# EasyEDA Pro project ProPrj_PCB_2025-05-19.epro, board 连接杆0.2
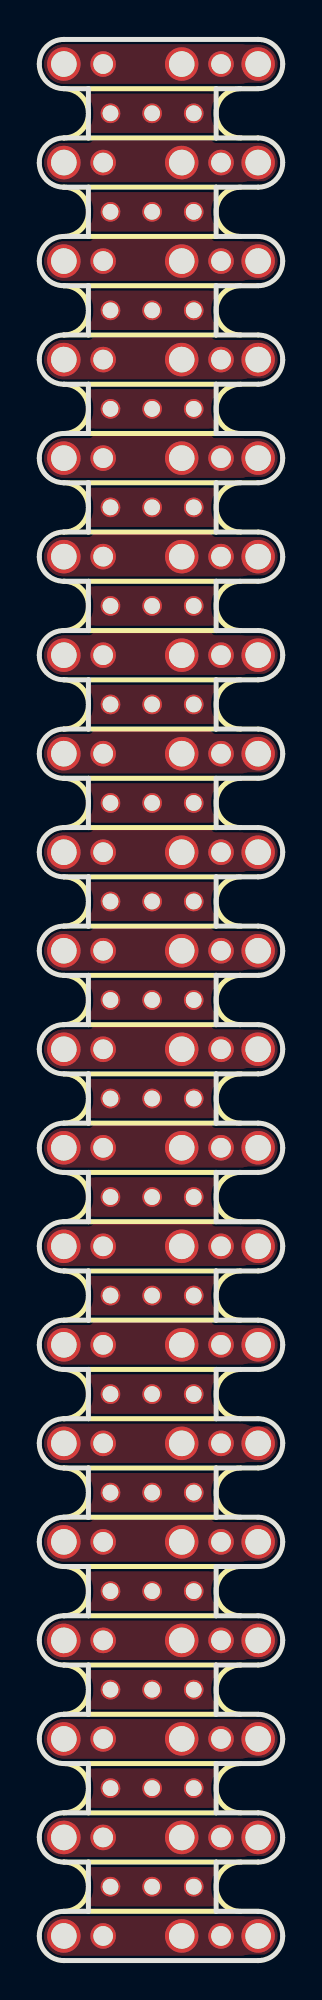
[diagram p6: board, top side]
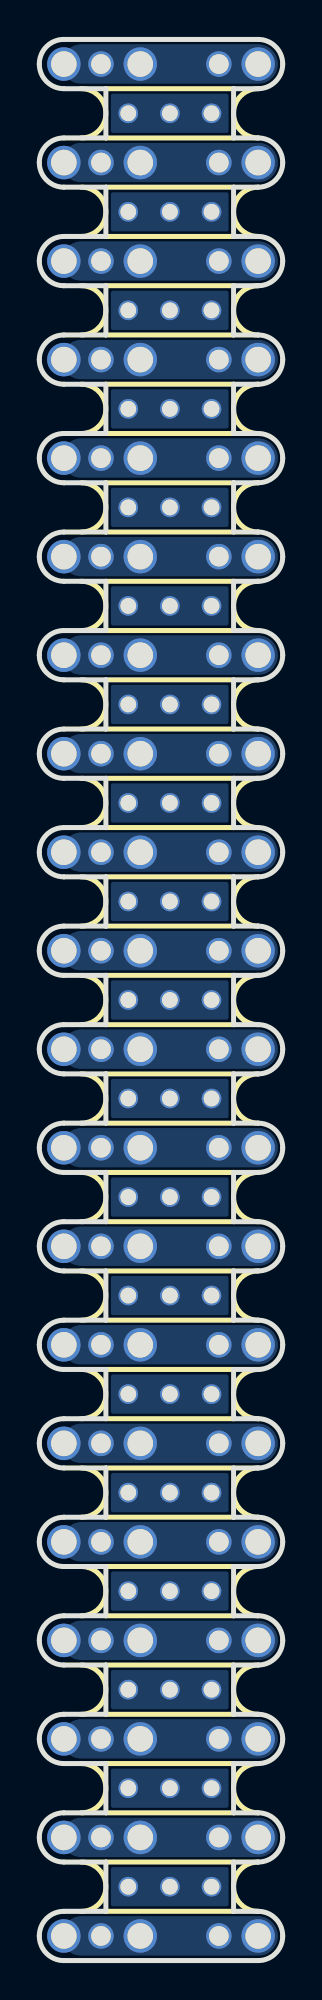
[diagram p7: board, bottom side, seen from below]

Outline 12.39 x 97.5 mm; copper layers: Top Layer, Bottom Layer. Coordinates in mm from the lower left corner of the outline.
Outline path: 0,96.25 arc(0.37,97.13) 1.25,97.5 11.14,97.5 arc(12.02,97.13) 12.39,96.25 arc(12.02,95.37) 11.14,95 9,95 9,92.5 11.14,92.5 arc(12.02,92.13) 12.39,91.25 arc(12.02,90.37) 11.14,90 9,90 9,87.5 11.14,87.5 arc(12.02,87.13) 12.39,86.25 arc(12.02,85.37) 11.14,85 9,85 9,82.5 11.14,82.5 arc(12.02,82.13) 12.39,81.25 arc(12.02,80.37) 11.14,80 9,80 9,77.5 11.14,77.5 arc(12.02,77.13) 12.39,76.25 arc(12.02,75.37) 11.14,75 9,75 9,72.5 11.14,72.5 arc(12.02,72.13) 12.39,71.25 arc(12.02,70.37) 11.14,70 9,70 9,67.5 11.14,67.5 arc(12.02,67.13) 12.39,66.25 arc(12.02,65.37) 11.14,65 9,65 9,62.5 11.14,62.5 arc(12.02,62.13) 12.39,61.25 arc(12.02,60.37) 11.14,60 9,60 9,57.5 11.14,57.5 arc(12.02,57.13) 12.39,56.25 arc(12.02,55.37) 11.14,55 9,55 9,52.5 11.14,52.5 arc(12.02,52.13) 12.39,51.25 arc(12.02,50.37) 11.14,50 9,50 9,47.5 11.14,47.5 arc(12.02,47.13) 12.39,46.25 arc(12.02,45.37) 11.14,45 9,45 9,42.5 11.14,42.5 arc(12.02,42.13) 12.39,41.25 arc(12.02,40.37) 11.14,40 9,40 9,37.5 11.14,37.5 arc(12.02,37.13) 12.39,36.25 arc(12.02,35.37) 11.14,35 9,35 9,32.5 11.14,32.5 arc(12.02,32.13) 12.39,31.25 arc(12.02,30.37) 11.14,30 9,30 9,27.5 11.14,27.5 arc(12.02,27.13) 12.39,26.25 arc(12.02,25.37) 11.14,25 9,25 9,22.5 11.14,22.5 arc(12.02,22.13) 12.39,21.25 arc(12.02,20.37) 11.14,20 9,20 9,17.5 11.14,17.5 arc(12.02,17.13) 12.39,16.25 arc(12.02,15.37) 11.14,15 9,15 9,12.5 11.14,12.5 arc(12.02,12.13) 12.39,11.25 arc(12.02,10.37) 11.14,10 9,10 9,7.5 11.14,7.5 arc(12.02,7.13) 12.39,6.25 arc(12.02,5.37) 11.14,5 9,5 9,2.5 11.14,2.5 arc(12.02,2.13) 12.39,1.25 arc(12.02,0.37) 11.14,0 1.25,0 arc(0.37,0.37) 0,1.25 arc(0.37,2.13) 1.25,2.5 2.5,2.5 2.5,5 1.25,5 arc(0.37,5.37) 0,6.25 arc(0.37,7.13) 1.25,7.5 2.5,7.5 2.5,10 1.25,10 arc(0.37,10.37) 0,11.25 arc(0.37,12.13) 1.25,12.5 2.5,12.5 2.5,15 1.25,15 arc(0.37,15.37) 0,16.25 arc(0.37,17.13) 1.25,17.5 2.5,17.5 2.5,20 1.25,20 arc(0.37,20.37) 0,21.25 arc(0.37,22.13) 1.25,22.5 2.5,22.5 2.5,25 1.25,25 arc(0.37,25.37) 0,26.25 arc(0.37,27.13) 1.25,27.5 2.5,27.5 2.5,30 1.25,30 arc(0.37,30.37) 0,31.25 arc(0.37,32.13) 1.25,32.5 2.5,32.5 2.5,35 1.25,35 arc(0.37,35.37) 0,36.25 arc(0.37,37.13) 1.25,37.5 2.5,37.5 2.5,40 1.25,40 arc(0.37,40.37) 0,41.25 arc(0.37,42.13) 1.25,42.5 2.5,42.5 2.5,45 1.25,45 arc(0.37,45.37) 0,46.25 arc(0.37,47.13) 1.25,47.5 2.5,47.5 2.5,50 1.25,50 arc(0.37,50.37) 0,51.25 arc(0.37,52.13) 1.25,52.5 2.5,52.5 2.5,55 1.25,55 arc(0.37,55.37) 0,56.25 arc(0.37,57.13) 1.25,57.5 2.5,57.5 2.5,60 1.25,60 arc(0.37,60.37) 0,61.25 arc(0.37,62.13) 1.25,62.5 2.5,62.5 2.5,65 1.25,65 arc(0.37,65.37) 0,66.25 arc(0.37,67.13) 1.25,67.5 2.5,67.5 2.5,70 1.25,70 arc(0.37,70.37) 0,71.25 arc(0.37,72.13) 1.25,72.5 2.5,72.5 2.5,75 1.25,75 arc(0.37,75.37) 0,76.25 arc(0.37,77.13) 1.25,77.5 2.5,77.5 2.5,80 1.25,80 arc(0.37,80.37) 0,81.25 arc(0.37,82.13) 1.25,82.5 2.5,82.5 2.5,85 1.25,85 arc(0.37,85.37) 0,86.25 arc(0.37,87.13) 1.25,87.5 2.5,87.5 2.5,90 1.25,90 arc(0.37,90.37) 0,91.25 arc(0.37,92.13) 1.25,92.5 2.5,92.5 2.5,95 1.25,95 arc(0.37,95.37) 0,96.25
Stack: Top Layer 0.035mm / Dielectric1 1.51mm FR4 er 4.5 / Bottom Layer 0.035mm

## Design rules (mm)
template: 自定义配置
spacing copperThickness1oz (default): track to track 0.102, other pairs 0.152 to 0.3
spacing copperThickness2oz: track to track 0.203, other pairs 0.152 to 0.3
track width copperThickness1oz (default): min 0.127, default 0.254, max 2.54
track width copperThickness2oz: min 0.203, default 0.254, max 2.54
differential pair differentialPair (default): width min 0.127, default 0.254, max 2.54; gap min 0.152, default 0.152
via viaSize (default): diameter min 0.5, default 0.61, max 10; hole min 0.3, default 0.305, max 6.3

## Placement (name value [footprint] x y rotation side)
NOREF  -  [Pad_e662]  3.62 73.75 180 top
NOREF#2  -  [Pad_e17]  3.25 1.25 180 top
NOREF#3  -  [Pad_e696]  7.86 13.75 0 top
NOREF#4  -  [Pad_e474]  3.25 81.25 180 top
NOREF#5  -  [Pad_e423]  7.25 66.25 180 top
NOREF#6  -  [Pad_e473]  1.25 81.25 180 top
NOREF#7  -  [Pad_e185]  7.25 36.25 180 top
NOREF#8  -  [Pad_e663]  7.86 68.75 0 top
NOREF#9  -  [Pad_e675]  7.86 48.75 0 top
NOREF#10  -  [Pad_e665]  3.62 68.75 180 top
NOREF#11  -  [Pad_e685]  5.74 33.75 180 top
NOREF#12  -  [Pad_e524]  1.25 96.25 180 top
NOREF#13  -  [Pad_e693]  7.86 18.75 0 top
NOREF#14  -  [Pad_e699]  7.86 8.75 0 top
NOREF#15  -  [Pad_e373]  9.25 51.25 180 top
NOREF#16  -  [Pad_e460]  11.14 76.25 180 top
NOREF#17  -  [Pad_e151]  7.25 26.25 180 top
NOREF#18  -  [Pad_e94]  7.25 16.25 180 top
NOREF#19  -  [Pad_e421]  1.25 66.25 180 top
NOREF#20  -  [Pad_e406]  7.25 61.25 180 top
NOREF#21  -  [Pad_e658]  5.74 78.75 180 top
NOREF#22  -  [Pad_e678]  7.86 43.75 0 top
NOREF#23  -  [Pad_e70]  7.25 6.25 180 top
NOREF#24  -  [Pad_e692]  3.62 23.75 180 top
NOREF#25  -  [Pad_e438]  1.25 71.25 180 top
NOREF#26  -  [Pad_e96]  11.14 16.25 180 top
NOREF#27  -  [Pad_e654]  7.86 83.75 0 top
NOREF#28  -  [Pad_e667]  5.74 63.75 180 top
NOREF#29  -  [Pad_e92]  1.25 16.25 180 top
NOREF#30  -  [Pad_e79]  1.25 11.25 180 top
NOREF#31  -  [Pad_e649]  5.74 93.75 180 top
NOREF#32  -  [Pad_e106]  3.25 21.25 180 top
NOREF#33  -  [Pad_e666]  7.86 63.75 0 top
NOREF#34  -  [Pad_e494]  11.14 86.25 180 top
NOREF#35  -  [Pad_e187]  11.14 36.25 180 top
NOREF#36  -  [Pad_e694]  5.74 18.75 180 top
NOREF#37  -  [Pad_e95]  9.25 16.25 180 top
NOREF#38  -  [Pad_e701]  3.62 8.75 180 top
NOREF#39  -  [Pad_e390]  9.25 56.25 180 top
NOREF#40  -  [Pad_e656]  3.62 83.75 180 top
NOREF#41  -  [Pad_e650]  7.86 93.75 0 top
NOREF#42  -  [Pad_e68]  1.25 6.25 180 top
NOREF#43  -  [Pad_e108]  9.25 21.25 180 top
NOREF#44  -  [Pad_e407]  9.25 61.25 180 top
NOREF#45  -  [Pad_e425]  11.14 66.25 180 top
NOREF#46  -  [Pad_e660]  7.86 73.75 0 top
NOREF#47  -  [Pad_e152]  9.25 26.25 180 top
NOREF#48  -  [Pad_e526]  7.25 96.25 180 top
NOREF#49  -  [Pad_e150]  3.25 26.25 180 top
NOREF#50  -  [Pad_e186]  9.25 36.25 180 top
NOREF#51  -  [Pad_e507]  1.25 91.25 180 top
NOREF#52  -  [Pad_e109]  11.14 21.25 180 top
NOREF#53  -  [Pad_e458]  7.25 76.25 180 top
NOREF#54  -  [Pad_e107]  7.25 21.25 180 top
NOREF#55  -  [Pad_e527]  9.25 96.25 180 top
NOREF#56  -  [Pad_e169]  9.25 31.25 180 top
NOREF#57  -  [Pad_e669]  7.86 58.75 0 top
NOREF#58  -  [Pad_e440]  7.25 71.25 180 top
NOREF#59  -  [Pad_e337]  3.25 41.25 180 top
NOREF#60  -  [Pad_e72]  11.14 6.25 180 top
NOREF#61  -  [Pad_e80]  3.25 11.25 180 top
NOREF#62  -  [Pad_e170]  11.14 31.25 180 top
NOREF#63  -  [Pad_e668]  3.62 63.75 180 top
NOREF#64  -  [Pad_e528]  11.14 96.25 180 top
NOREF#65  -  [Pad_e688]  5.74 28.75 180 top
NOREF#66  -  [Pad_e13]  1.25 1.25 180 top
NOREF#67  -  [Pad_e655]  5.74 83.75 180 top
NOREF#68  -  [Pad_e659]  3.62 78.75 180 top
NOREF#69  -  [Pad_e167]  3.25 31.25 180 top
NOREF#70  -  [Pad_e408]  11.14 61.25 180 top
NOREF#71  -  [Pad_e703]  5.74 3.75 180 top
NOREF#72  -  [Pad_e681]  7.86 38.75 0 top
NOREF#73  -  [Pad_e651]  7.86 88.75 0 top
NOREF#74  -  [Pad_e492]  7.25 86.25 180 top
NOREF#75  -  [Pad_e456]  1.25 76.25 180 top
NOREF#76  -  [Pad_e664]  5.74 68.75 180 top
NOREF#77  -  [Pad_e672]  7.86 53.75 0 top
NOREF#78  -  [Pad_e442]  11.14 71.25 180 top
NOREF#79  -  [Pad_e441]  9.25 71.25 180 top
NOREF#80  -  [Pad_e673]  5.74 53.75 180 top
NOREF#81  -  [Pad_e374]  11.14 51.25 180 top
NOREF#82  -  [Pad_e641]  3.62 93.75 180 top
NOREF#83  -  [Pad_e689]  3.62 28.75 180 top
NOREF#84  -  [Pad_e493]  9.25 86.25 180 top
NOREF#85  -  [Pad_e684]  7.86 33.75 0 top
NOREF#86  -  [Pad_e661]  5.74 73.75 180 top
NOREF#87  -  [Pad_e700]  5.74 8.75 180 top
NOREF#88  -  [Pad_e336]  1.25 41.25 180 top
NOREF#89  -  [Pad_e670]  5.74 58.75 180 top
NOREF#90  -  [Pad_e370]  1.25 51.25 180 top
NOREF#91  -  [Pad_e20]  11.14 1.25 180 top
NOREF#92  -  [Pad_e404]  1.25 61.25 180 top
NOREF#93  -  [Pad_e439]  3.25 71.25 180 top
NOREF#94  -  [Pad_e153]  11.14 26.25 180 top
NOREF#95  -  [Pad_e459]  9.25 76.25 180 top
NOREF#96  -  [Pad_e680]  3.62 43.75 180 top
NOREF#97  -  [Pad_e691]  5.74 23.75 180 top
NOREF#98  -  [Pad_e695]  3.62 18.75 180 top
NOREF#99  -  [Pad_e356]  9.25 46.25 180 top
NOREF#100  -  [Pad_e697]  5.74 13.75 180 top
NOREF#101  -  [Pad_e676]  5.74 48.75 180 top
NOREF#102  -  [Pad_e71]  9.25 6.25 180 top
NOREF#103  -  [Pad_e69]  3.25 6.25 180 top
NOREF#104  -  [Pad_e682]  5.74 38.75 180 top
NOREF#105  -  [Pad_e653]  3.62 88.75 180 top
NOREF#106  -  [Pad_e477]  11.14 81.25 180 top
NOREF#107  -  [Pad_e105]  1.25 21.25 180 top
NOREF#108  -  [Pad_e652]  5.74 88.75 180 top
NOREF#109  -  [Pad_e340]  11.14 41.25 180 top
NOREF#110  -  [Pad_e371]  3.25 51.25 180 top
NOREF#111  -  [Pad_e490]  1.25 86.25 180 top
NOREF#112  -  [Pad_e355]  7.25 46.25 180 top
NOREF#113  -  [Pad_e679]  5.74 43.75 180 top
NOREF#114  -  [Pad_e475]  7.25 81.25 180 top
NOREF#115  -  [Pad_e686]  3.62 33.75 180 top
NOREF#116  -  [Pad_e353]  1.25 46.25 180 top
NOREF#117  -  [Pad_e389]  7.25 56.25 180 top
NOREF#118  -  [Pad_e354]  3.25 46.25 180 top
NOREF#119  -  [Pad_e683]  3.62 38.75 180 top
NOREF#120  -  [Pad_e149]  1.25 26.25 180 top
NOREF#121  -  [Pad_e183]  1.25 36.25 180 top
NOREF#122  -  [Pad_e339]  9.25 41.25 180 top
NOREF#123  -  [Pad_e168]  7.25 31.25 180 top
NOREF#124  -  [Pad_e391]  11.14 56.25 180 top
NOREF#125  -  [Pad_e510]  9.25 91.25 180 top
NOREF#126  -  [Pad_e93]  3.25 16.25 180 top
NOREF#127  -  [Pad_e372]  7.25 51.25 180 top
NOREF#128  -  [Pad_e674]  3.62 53.75 180 top
NOREF#129  -  [Pad_e357]  11.14 46.25 180 top
NOREF#130  -  [Pad_e338]  7.25 41.25 180 top
NOREF#131  -  [Pad_e508]  3.25 91.25 180 top
NOREF#132  -  [Pad_e657]  7.86 78.75 0 top
NOREF#133  -  [Pad_e687]  7.86 28.75 0 top
NOREF#134  -  [Pad_e422]  3.25 66.25 180 top
NOREF#135  -  [Pad_e525]  3.25 96.25 180 top
NOREF#136  -  [Pad_e83]  11.14 11.25 180 top
NOREF#137  -  [Pad_e457]  3.25 76.25 180 top
NOREF#138  -  [Pad_e184]  3.25 36.25 180 top
NOREF#139  -  [Pad_e476]  9.25 81.25 180 top
NOREF#140  -  [Pad_e509]  7.25 91.25 180 top
NOREF#141  -  [Pad_e671]  3.62 58.75 180 top
NOREF#142  -  [Pad_e19]  9.25 1.25 180 top
NOREF#143  -  [Pad_e387]  1.25 56.25 180 top
NOREF#144  -  [Pad_e82]  9.25 11.25 180 top
NOREF#145  -  [Pad_e698]  3.62 13.75 180 top
NOREF#146  -  [Pad_e81]  7.25 11.25 180 top
NOREF#147  -  [Pad_e166]  1.25 31.25 180 top
NOREF#148  -  [Pad_e677]  3.62 48.75 180 top
NOREF#149  -  [Pad_e702]  7.86 3.75 0 top
NOREF#150  -  [Pad_e405]  3.25 61.25 180 top
NOREF#151  -  [Pad_e704]  3.62 3.75 180 top
NOREF#152  -  [Pad_e424]  9.25 66.25 180 top
NOREF#153  -  [Pad_e18]  7.25 1.25 180 top
NOREF#154  -  [Pad_e511]  11.14 91.25 180 top
NOREF#155  -  [Pad_e388]  3.25 56.25 180 top
NOREF#156  -  [Pad_e491]  3.25 86.25 180 top
NOREF#157  -  [Pad_e690]  7.86 23.75 0 top

## Footprints (pads in the part's own frame, mm; a bottom-side part is the same pattern mirrored in y, then rotated)
Pad_e13
  round 1.7 hole 1.3: 1(0,0)
Pad_e17
  round 1.3 hole 1: 1(0,0)
Pad_e18
  round 1.7 hole 1.3: 1(0,0)
Pad_e19
  round 1.3 hole 1: 1(0,0)
Pad_e20
  round 1.7 hole 1.3: 1(0,0)
Pad_e68
  round 1.7 hole 1.3: 1(0,0)
Pad_e69
  round 1.3 hole 1: 1(0,0)
Pad_e70
  round 1.7 hole 1.3: 1(0,0)
Pad_e71
  round 1.3 hole 1: 1(0,0)
Pad_e72
  round 1.7 hole 1.3: 1(0,0)
Pad_e79
  round 1.7 hole 1.3: 1(0,0)
Pad_e80
  round 1.3 hole 1: 1(0,0)
Pad_e81
  round 1.7 hole 1.3: 1(0,0)
Pad_e82
  round 1.3 hole 1: 1(0,0)
Pad_e83
  round 1.7 hole 1.3: 1(0,0)
Pad_e92
  round 1.7 hole 1.3: 1(0,0)
Pad_e93
  round 1.3 hole 1: 1(0,0)
Pad_e94
  round 1.7 hole 1.3: 1(0,0)
Pad_e95
  round 1.3 hole 1: 1(0,0)
Pad_e96
  round 1.7 hole 1.3: 1(0,0)
Pad_e105
  round 1.7 hole 1.3: 1(0,0)
Pad_e106
  round 1.3 hole 1: 1(0,0)
Pad_e107
  round 1.7 hole 1.3: 1(0,0)
Pad_e108
  round 1.3 hole 1: 1(0,0)
Pad_e109
  round 1.7 hole 1.3: 1(0,0)
Pad_e149
  round 1.7 hole 1.3: 1(0,0)
Pad_e150
  round 1.3 hole 1: 1(0,0)
Pad_e151
  round 1.7 hole 1.3: 1(0,0)
Pad_e152
  round 1.3 hole 1: 1(0,0)
Pad_e153
  round 1.7 hole 1.3: 1(0,0)
Pad_e166
  round 1.7 hole 1.3: 1(0,0)
Pad_e167
  round 1.3 hole 1: 1(0,0)
Pad_e168
  round 1.7 hole 1.3: 1(0,0)
Pad_e169
  round 1.3 hole 1: 1(0,0)
Pad_e170
  round 1.7 hole 1.3: 1(0,0)
Pad_e183
  round 1.7 hole 1.3: 1(0,0)
Pad_e184
  round 1.3 hole 1: 1(0,0)
Pad_e185
  round 1.7 hole 1.3: 1(0,0)
Pad_e186
  round 1.3 hole 1: 1(0,0)
Pad_e187
  round 1.7 hole 1.3: 1(0,0)
Pad_e336
  round 1.7 hole 1.3: 1(0,0)
Pad_e337
  round 1.3 hole 1: 1(0,0)
Pad_e338
  round 1.7 hole 1.3: 1(0,0)
Pad_e339
  round 1.3 hole 1: 1(0,0)
Pad_e340
  round 1.7 hole 1.3: 1(0,0)
Pad_e353
  round 1.7 hole 1.3: 1(0,0)
Pad_e354
  round 1.3 hole 1: 1(0,0)
Pad_e355
  round 1.7 hole 1.3: 1(0,0)
Pad_e356
  round 1.3 hole 1: 1(0,0)
Pad_e357
  round 1.7 hole 1.3: 1(0,0)
Pad_e370
  round 1.7 hole 1.3: 1(0,0)
Pad_e371
  round 1.3 hole 1: 1(0,0)
Pad_e372
  round 1.7 hole 1.3: 1(0,0)
Pad_e373
  round 1.3 hole 1: 1(0,0)
Pad_e374
  round 1.7 hole 1.3: 1(0,0)
Pad_e387
  round 1.7 hole 1.3: 1(0,0)
Pad_e388
  round 1.3 hole 1: 1(0,0)
Pad_e389
  round 1.7 hole 1.3: 1(0,0)
Pad_e390
  round 1.3 hole 1: 1(0,0)
Pad_e391
  round 1.7 hole 1.3: 1(0,0)
Pad_e404
  round 1.7 hole 1.3: 1(0,0)
Pad_e405
  round 1.3 hole 1: 1(0,0)
Pad_e406
  round 1.7 hole 1.3: 1(0,0)
Pad_e407
  round 1.3 hole 1: 1(0,0)
Pad_e408
  round 1.7 hole 1.3: 1(0,0)
Pad_e421
  round 1.7 hole 1.3: 1(0,0)
Pad_e422
  round 1.3 hole 1: 1(0,0)
Pad_e423
  round 1.7 hole 1.3: 1(0,0)
Pad_e424
  round 1.3 hole 1: 1(0,0)
Pad_e425
  round 1.7 hole 1.3: 1(0,0)
Pad_e438
  round 1.7 hole 1.3: 1(0,0)
Pad_e439
  round 1.3 hole 1: 1(0,0)
Pad_e440
  round 1.7 hole 1.3: 1(0,0)
Pad_e441
  round 1.3 hole 1: 1(0,0)
Pad_e442
  round 1.7 hole 1.3: 1(0,0)
Pad_e456
  round 1.7 hole 1.3: 1(0,0)
Pad_e457
  round 1.3 hole 1: 1(0,0)
Pad_e458
  round 1.7 hole 1.3: 1(0,0)
Pad_e459
  round 1.3 hole 1: 1(0,0)
Pad_e460
  round 1.7 hole 1.3: 1(0,0)
Pad_e473
  round 1.7 hole 1.3: 1(0,0)
Pad_e474
  round 1.3 hole 1: 1(0,0)
Pad_e475
  round 1.7 hole 1.3: 1(0,0)
Pad_e476
  round 1.3 hole 1: 1(0,0)
Pad_e477
  round 1.7 hole 1.3: 1(0,0)
Pad_e490
  round 1.7 hole 1.3: 1(0,0)
Pad_e491
  round 1.3 hole 1: 1(0,0)
Pad_e492
  round 1.7 hole 1.3: 1(0,0)
Pad_e493
  round 1.3 hole 1: 1(0,0)
Pad_e494
  round 1.7 hole 1.3: 1(0,0)
Pad_e507
  round 1.7 hole 1.3: 1(0,0)
Pad_e508
  round 1.3 hole 1: 1(0,0)
Pad_e509
  round 1.7 hole 1.3: 1(0,0)
Pad_e510
  round 1.3 hole 1: 1(0,0)
Pad_e511
  round 1.7 hole 1.3: 1(0,0)
Pad_e524
  round 1.7 hole 1.3: 1(0,0)
Pad_e525
  round 1.3 hole 1: 1(0,0)
Pad_e526
  round 1.7 hole 1.3: 1(0,0)
Pad_e527
  round 1.3 hole 1: 1(0,0)
Pad_e528
  round 1.7 hole 1.3: 1(0,0)
Pad_e641
  round 1 hole 0.8: 1(0,0)
Pad_e649
  round 1 hole 0.8: 1(0,0)
Pad_e650
  round 1 hole 0.8: 1(0,0)
Pad_e651
  round 1 hole 0.8: 1(0,0)
Pad_e652
  round 1 hole 0.8: 1(0,0)
Pad_e653
  round 1 hole 0.8: 1(0,0)
Pad_e654
  round 1 hole 0.8: 1(0,0)
Pad_e655
  round 1 hole 0.8: 1(0,0)
Pad_e656
  round 1 hole 0.8: 1(0,0)
Pad_e657
  round 1 hole 0.8: 1(0,0)
Pad_e658
  round 1 hole 0.8: 1(0,0)
Pad_e659
  round 1 hole 0.8: 1(0,0)
Pad_e660
  round 1 hole 0.8: 1(0,0)
Pad_e661
  round 1 hole 0.8: 1(0,0)
Pad_e662
  round 1 hole 0.8: 1(0,0)
Pad_e663
  round 1 hole 0.8: 1(0,0)
Pad_e664
  round 1 hole 0.8: 1(0,0)
Pad_e665
  round 1 hole 0.8: 1(0,0)
Pad_e666
  round 1 hole 0.8: 1(0,0)
Pad_e667
  round 1 hole 0.8: 1(0,0)
Pad_e668
  round 1 hole 0.8: 1(0,0)
Pad_e669
  round 1 hole 0.8: 1(0,0)
Pad_e670
  round 1 hole 0.8: 1(0,0)
Pad_e671
  round 1 hole 0.8: 1(0,0)
Pad_e672
  round 1 hole 0.8: 1(0,0)
Pad_e673
  round 1 hole 0.8: 1(0,0)
Pad_e674
  round 1 hole 0.8: 1(0,0)
Pad_e675
  round 1 hole 0.8: 1(0,0)
Pad_e676
  round 1 hole 0.8: 1(0,0)
Pad_e677
  round 1 hole 0.8: 1(0,0)
Pad_e678
  round 1 hole 0.8: 1(0,0)
Pad_e679
  round 1 hole 0.8: 1(0,0)
Pad_e680
  round 1 hole 0.8: 1(0,0)
Pad_e681
  round 1 hole 0.8: 1(0,0)
Pad_e682
  round 1 hole 0.8: 1(0,0)
Pad_e683
  round 1 hole 0.8: 1(0,0)
Pad_e684
  round 1 hole 0.8: 1(0,0)
Pad_e685
  round 1 hole 0.8: 1(0,0)
Pad_e686
  round 1 hole 0.8: 1(0,0)
Pad_e687
  round 1 hole 0.8: 1(0,0)
Pad_e688
  round 1 hole 0.8: 1(0,0)
Pad_e689
  round 1 hole 0.8: 1(0,0)
Pad_e690
  round 1 hole 0.8: 1(0,0)
Pad_e691
  round 1 hole 0.8: 1(0,0)
Pad_e692
  round 1 hole 0.8: 1(0,0)
Pad_e693
  round 1 hole 0.8: 1(0,0)
Pad_e694
  round 1 hole 0.8: 1(0,0)
Pad_e695
  round 1 hole 0.8: 1(0,0)
Pad_e696
  round 1 hole 0.8: 1(0,0)
Pad_e697
  round 1 hole 0.8: 1(0,0)
Pad_e698
  round 1 hole 0.8: 1(0,0)
Pad_e699
  round 1 hole 0.8: 1(0,0)
Pad_e700
  round 1 hole 0.8: 1(0,0)
Pad_e701
  round 1 hole 0.8: 1(0,0)
Pad_e702
  round 1 hole 0.8: 1(0,0)
Pad_e703
  round 1 hole 0.8: 1(0,0)
Pad_e704
  round 1 hole 0.8: 1(0,0)

## Nets
GND: NOREF.1 NOREF#2.1 NOREF#3.1 NOREF#4.1 NOREF#5.1 NOREF#6.1 NOREF#7.1 NOREF#8.1 NOREF#9.1 NOREF#10.1 NOREF#11.1 NOREF#12.1 NOREF#13.1 NOREF#14.1 NOREF#15.1 NOREF#16.1 NOREF#17.1 NOREF#18.1 NOREF#19.1 NOREF#20.1 NOREF#21.1 NOREF#22.1 NOREF#23.1 NOREF#24.1 NOREF#25.1 NOREF#26.1 NOREF#27.1 NOREF#28.1 NOREF#29.1 NOREF#30.1 NOREF#31.1 NOREF#32.1 NOREF#33.1 NOREF#34.1 NOREF#35.1 NOREF#36.1 NOREF#37.1 NOREF#38.1 NOREF#39.1 NOREF#40.1 NOREF#41.1 NOREF#42.1 NOREF#43.1 NOREF#44.1 NOREF#45.1 NOREF#46.1 NOREF#47.1 NOREF#48.1 NOREF#49.1 NOREF#50.1 NOREF#51.1 NOREF#52.1 NOREF#53.1 NOREF#54.1 NOREF#55.1 NOREF#56.1 NOREF#57.1 NOREF#58.1 NOREF#59.1 NOREF#60.1 NOREF#61.1 NOREF#62.1 NOREF#63.1 NOREF#64.1 NOREF#65.1 NOREF#66.1 NOREF#67.1 NOREF#68.1 NOREF#69.1 NOREF#70.1 NOREF#71.1 NOREF#72.1 NOREF#73.1 NOREF#74.1 NOREF#75.1 NOREF#76.1 NOREF#77.1 NOREF#78.1 NOREF#79.1 NOREF#80.1 NOREF#81.1 NOREF#82.1 NOREF#83.1 NOREF#84.1 NOREF#85.1 NOREF#86.1 NOREF#87.1 NOREF#88.1 NOREF#89.1 NOREF#90.1 NOREF#91.1 NOREF#92.1 NOREF#93.1 NOREF#94.1 NOREF#95.1 NOREF#96.1 NOREF#97.1 NOREF#98.1 NOREF#99.1 NOREF#100.1 NOREF#101.1 NOREF#102.1 NOREF#103.1 NOREF#104.1 NOREF#105.1 NOREF#106.1 NOREF#107.1 NOREF#108.1 NOREF#109.1 NOREF#110.1 NOREF#111.1 NOREF#112.1 NOREF#113.1 NOREF#114.1 NOREF#115.1 NOREF#116.1 NOREF#117.1 NOREF#118.1 NOREF#119.1 NOREF#120.1 NOREF#121.1 NOREF#122.1 NOREF#123.1 NOREF#124.1 NOREF#125.1 NOREF#126.1 NOREF#127.1 NOREF#128.1 NOREF#129.1 NOREF#130.1 NOREF#131.1 NOREF#132.1 NOREF#133.1 NOREF#134.1 NOREF#135.1 NOREF#136.1 NOREF#137.1 NOREF#138.1 NOREF#139.1 NOREF#140.1 NOREF#141.1 NOREF#142.1 NOREF#143.1 NOREF#144.1 NOREF#145.1 NOREF#146.1 NOREF#147.1 NOREF#148.1 NOREF#149.1 NOREF#150.1 NOREF#151.1 NOREF#152.1 NOREF#153.1 NOREF#154.1 NOREF#155.1 NOREF#156.1 NOREF#157.1

## Copper pours and planes (outline as drawn; the poured copper is in the pictures)
GND on Top Layer: 0.04,57.5 12.74,57.5 12.74,55.3 0.04,55.3
GND on Top Layer: 0.04,22.5 12.61,22.5 12.61,20.3 0.04,20.3
GND on Top Layer: 0.04,62.5 12.61,62.5 12.61,60.3 0.04,60.3
GND on Top Layer: 0.04,7.25 12.61,7.25 12.61,5.3 0.04,5.3
GND on Top Layer: 0.04,47.5 12.61,47.5 12.61,45.3 0.04,45.3
GND on Top Layer: -2.25,98.15 15.4,98.15 15.4,-1.54 -2.25,-1.54
GND on Top Layer: 0.04,42.5 12.36,42.5 12.36,40.3 0.04,40.3
GND on Top Layer: 0.04,67.5 13.12,67.5 13.12,65.3 0.04,65.3
GND on Top Layer: 0.04,77.5 12.74,77.5 12.74,75.3 0.04,75.3
GND on Top Layer: 0.04,12.25 12.48,12.25 12.48,10.3 0.04,10.3
GND on Top Layer: 0.04,52.5 13.12,52.5 13.12,50.3 0.04,50.3
GND on Top Layer: 0.04,2.25 12.48,2.25 12.48,0.3 0.04,0.3
GND on Top Layer: 0.04,17.25 12.48,17.25 12.48,15.3 0.04,15.3
GND on Top Layer: 0.04,37.5 12.74,37.5 12.74,35.3 0.04,35.3
GND on Top Layer: 0.04,72.5 12.99,72.5 12.99,70.3 0.04,70.3
GND on Top Layer: 0.04,82.5 12.61,82.5 12.61,80.3 0.04,80.3
GND on Top Layer: 0.04,27.12 12.36,27.12 12.36,25.3 0.04,25.3
GND on Top Layer: 0.04,97.5 12.61,97.5 12.61,95.3 0.04,95.3
GND on Top Layer: 0.04,92.5 12.86,92.5 12.86,90.3 0.04,90.3
GND on Top Layer: 0.04,32.5 12.48,32.5 12.48,30.3 0.04,30.3
GND on Top Layer: -1.61,99.29 14.26,99.29 14.26,-3.19 -1.61,-3.19
GND on Top Layer: 0.04,87.5 13.75,87.5 13.75,85.3 0.04,85.3
GND on Bottom Layer: 0.04,37.5 11.47,37.5 11.47,35.3 0.04,35.3
GND on Bottom Layer: 0.04,32.5 11.47,32.5 11.47,30.3 0.04,30.3
GND on Bottom Layer: 0.04,2.25 11.47,2.25 11.47,0.3 0.04,0.3
GND on Bottom Layer: 0.04,52.5 11.47,52.5 11.47,50.3 0.04,50.3
GND on Bottom Layer: 0.04,62.5 11.47,62.5 11.47,60.3 0.04,60.3
GND on Bottom Layer: 0.04,97.5 11.47,97.5 11.47,95.3 0.04,95.3
GND on Bottom Layer: 0.04,47.5 11.47,47.5 11.47,45.3 0.04,45.3
GND on Bottom Layer: 0.04,27.5 11.47,27.5 11.47,25.3 0.04,25.3
GND on Bottom Layer: 0.04,12.25 11.47,12.25 11.47,10.3 0.04,10.3
GND on Bottom Layer: 0.04,77.5 11.47,77.5 11.47,75.3 0.04,75.3
GND on Bottom Layer: 0.04,22.5 11.47,22.5 11.47,20.3 0.04,20.3
GND on Bottom Layer: 0.04,57.5 11.47,57.5 11.47,55.3 0.04,55.3
GND on Bottom Layer: 0.04,92.5 11.47,92.5 11.47,90.3 0.04,90.3
GND on Bottom Layer: 0.04,42.5 11.47,42.5 11.47,40.3 0.04,40.3
GND on Bottom Layer: 0.04,67.5 11.47,67.5 11.47,65.3 0.04,65.3
GND on Bottom Layer: 0.04,7.25 11.47,7.25 11.47,5.3 0.04,5.3
GND on Bottom Layer: 0.04,82.5 11.47,82.5 11.47,80.3 0.04,80.3
GND on Bottom Layer: -2.63,99.29 12.74,99.29 12.74,-0.66 -2.63,-0.66
GND on Bottom Layer: 0.04,17.25 11.47,17.25 11.47,15.3 0.04,15.3
GND on Bottom Layer: 0.04,72.5 11.47,72.5 11.47,70.3 0.04,70.3
GND on Bottom Layer: 0.04,87.5 11.47,87.5 11.47,85.3 0.04,85.3
